# EAGLE design digital-psu (EAGLE 7.6.0)
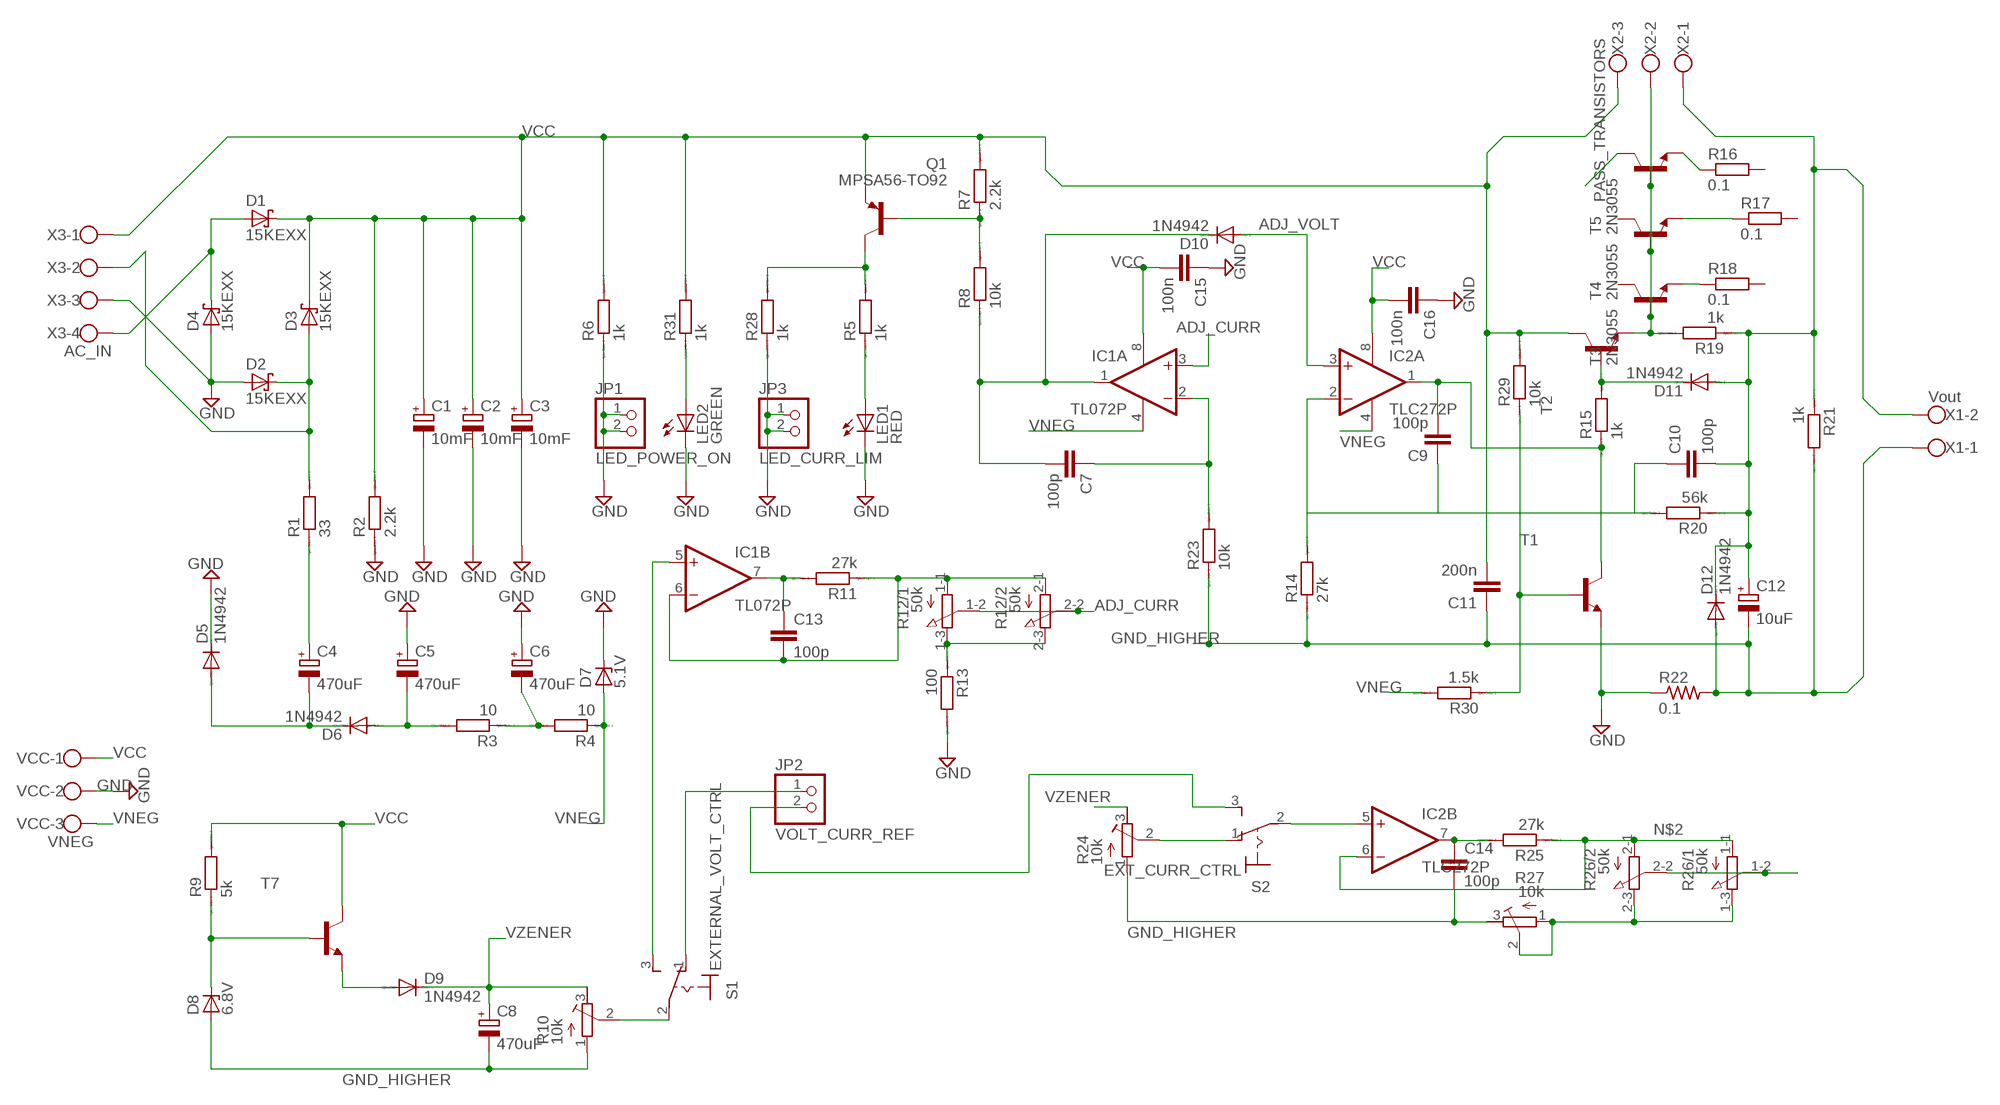
[diagram p0: schematic, sheet 1]

## Parts
C1  10mF  CPOL-EUE10-22.5  [EB22,5D]
C2  10mF  CPOL-EUE10-22.5  [EB22,5D]
C3  10mF  CPOL-EUE10-22.5  [EB22,5D]
C4  470uF  CPOL-EUE5-10.5  [E5-10,5]
C5  470uF  CPOL-EUE5-10.5  [E5-10,5]
C6  470uF  CPOL-EUE5-10.5  [E5-10,5]
C7  100p  C-EUC0805  [C0805]
C8  470uF  CPOL-EUE5-10.5  [E5-10,5]
C9  100p  C-EUC0805  [C0805]
C10  100p  C-EUC0805  [C0805]
C11  200n  C-EUC0805  [C0805]
C12  10uF  CPOL-EUE5-10.5  [E5-10,5]
C13  100p  C-EUC0805  [C0805]
C14  100p  C-EUC0805  [C0805]
C15  100n  C-EUC0805  [C0805]
C16  100n  C-EUC0805  [C0805]
D1  15KEXX  [CB429-17]
D2  15KEXX  [CB429-17]
D3  15KEXX  [CB429-17]
D4  15KEXX  [CB429-17]
D5  1N4942  [DO41-10]
D6  1N4942  [DO41-10]
D7  5.1V  ZENER-DIODEC1702-15  [C1702-15]
D8  6.8V  ZENER-DIODEC1702-15  [C1702-15]
D9  1N4942  [DO41-10]
D10  1N4942  [DO41-10]
D11  1N4942  [DO41-10]
D12  1N4942  [DO41-10]
IC1  TL072P  [DIL08]
IC2  TLC272P  [DIL08]
JP1  LED_POWER_ON  PINHD-1X2  [1X02]
JP2  VOLT_CURR_REF  PINHD-1X2  [1X02]
JP3  LED_CURR_LIM  PINHD-1X2  [1X02]
LED1  RED  LED5MM  [LED5MM]
LED2  GREEN  LED5MM  [LED5MM]
Q1  MPSA56-TO92  [TO92-CBE]
R1  33  R  [R0805]
R2  2.2k  R  [R0805]
R3  10  R  [R0805]
R4  10  R  [R0805]
R5  1k  R  [R0805]
R6  1k  R  [R0805]
R7  2.2k  R  [R0805]
R8  10k  R  [R0805]
R9  5k  R  [R0805]
R10  10k  R-TRIMM64W  [RTRIM64W]
R11  27k  R  [R0805]
R12  50k  3RP/1610G  [3RP/1610G]
R13  100  R  [R0805]
R14  27k  R  [R0805]
R15  1k  R  [R0805]
R16  0.1  R-EU_VTA55  [VTA55]
R17  0.1  R-EU_VTA55  [VTA55]
R18  0.1  R-EU_VTA55  [VTA55]
R19  1k  R  [R0805]
R20  56k  R  [R0805]
R21  1k  R  [R0805]
R22  0.1  R-US_VTA52  [VTA52]
R23  10k  R  [R0805]
R24  10k  R-TRIMM64W  [RTRIM64W]
R25  27k  R  [R0805]
R26  50k  3RP/1610G  [3RP/1610G]
R27  10k  R-TRIMM64W  [RTRIM64W]
R28  1k  R  [R0805]
R29  10k  R  [R0805]
R30  1.5k  R  [R0805]
R31  1k  R  [R0805]
S1  EXTERNAL_VOLT_CTRL  320-916  [320-916]
S2  EXT_CURR_CTRL  320-916  [320-916]
T1  -NPN-TO92-EBC  [TO92-EBC]
T2  -NPN-TO92-EBC  [TO92-EBC]
T3  2N3055  -NPN-TO3/  [TO3]
T4  2N3055  -NPN-TO3/  [TO3]
T5  2N3055  -NPN-TO3/  [TO3]
T7  -NPN-TO92-EBC  [TO92-EBC]
VCC  VNEG  W237-103  [W237-103]
X1  Vout  W237-113  [W237-113]
X2  PASS_TRANSISTORS  W237-103  [W237-103]
X3  AC_IN  W237-4  [W237-4]

## Nets
ADJ_CURR: IC1.3(A:+IN) R12.1-2(/1:S) R12.2-2(/2:S)
ADJ_VOLT: D10.A IC2.3(A:+IN) R26.1-2(/1:S) R26.2-2(/2:S)
GND: C1.- C2.- C3.- C5.+ C6.+ C15.1 C16.1 D2.A D4.A D5.C D7.C JP1.1 JP1.2 JP3.1 JP3.2 LED1.K(C) LED2.K(C) R2.1 R6.1 R13.2 R22.1 R28.1 T1.E VCC.2 X3.3
GND_HIGHER: C8.- C11.1 C12.- C14.2 D8.A D12.A R10.1(A) R14.1 R21.2 R22.2 R23.1 R24.1(A) R27.3(E) X1.1
N$1: D2.C D3.A R1.2 X3.2
N$2: IC2.6(B:-IN) R25.1 R26.1-1(/1:A) R26.2-1(/2:A)
N$3: D1.A D4.C X3.4
N$4: R10.2(S) S1.2(P)
N$6: C4.- D5.A D6.C
N$7: C5.- D6.A R3.2
N$8: C6.- R3.1 R4.2
N$9: T5.C
N$10: LED2.A R31.1
N$11: Q1.C R5.2 R28.2
N$12: LED1.A R5.1
N$14: Q1.B R7.1 R8.2
N$15: C7.2 D10.C IC1.1(A:OUT) R8.1
N$16: D8.C R9.1 T7.B
N$17: R29.1 R30.1 T1.B
N$18: C7.1 IC1.2(A:-IN) R23.2
N$19: D9.A T7.E
N$20: C13.2 IC1.6(B:-IN) R11.1 R12.1-1(/1:A) R12.2-1(/2:A)
N$22: JP2.2 S2.3(S)
N$23: C13.1 IC1.7(B:OUT) R11.2
N$24: R18.1 T3.E
N$25: R17.1 T4.E
N$26: R16.1 T5.E
N$27: R19.2 T2.E T3.B T4.B T5.B X2.2
N$28: D11.C R15.2 T2.B
N$29: R24.2(S) S2.1(O)
N$30: C14.1 IC2.7(B:OUT) R25.2
N$31: C9.2 IC2.1(A:OUT) R15.1 T1.C
N$32: R12.1-3(/1:E) R12.2-3(/2:E) R13.1
N$34: IC2.5(B:+IN) S2.2(P)
N$35: C4.+ R1.1
N$36: R26.1-3(/1:E) R26.2-3(/2:E) R27.1(A) R27.2(S)
N$38: C9.1 C10.1 IC2.2(A:-IN) R14.2 R20.2
N$41: C10.2 C12.+ D11.A D12.C R19.1 R20.1 R21.1 X1.2 X2.1
N$43: JP2.1 S1.1(O)
N$44: IC1.5(B:+IN) S1.3(S)
VCC: C1.+ C2.+ C3.+ C11.2 C15.2 C16.2 D1.C D3.C IC1.8(P:V+) IC2.8(P:V+) Q1.E R2.2 R6.2 R7.2 R9.2 R29.2 R31.2 T2.C T7.C VCC.1 X2.3 X3.1
VNEG: D7.A IC1.4(P:V-) IC2.4(P:V-) R4.1 R30.2 VCC.3
VZENER: C8.+ D9.C R10.3(E) R24.3(E)
Unconnected: R16.2 R17.2 R18.2 T3.C T4.C

## Library data of the parts
C1-C6 C8 C12 = resistor:CPOL-EU: POLARIZED CAPACITOR, European symbol
C7 C9-C11 C13-C16 = rcl:C-EU: CAPACITOR, European symbol
D1-D4 = diode:15KEXX: DIODE
D5 D6 D9-D12 = diode:1N4942: DIODE 1.0 A, 200 V, 150 ns
D7 D8 = diode:ZENER-DIODE: Z-Diode
IC1 = linear:TL072: OP AMP
IC2 = linear:TLC272: OP AMP
JP1-JP3 = pinhead:PINHD-1X2: PIN HEADER
LED1 LED2 = led:LED: LED OSRAM: - CHIPLED LG R971, LG N971, LY N971, LG Q971, LY Q971, LO R971, LY R971 LH N974, LH R974 LS Q976, LO Q976, LY Q976 LO Q996 - Hyper CHIPLED LW Q18S LB Q993, LB Q99A, LB R99A - SideLED LS A670, LO A670, LY A670, LG A670, LP A670 LB A673, LV A673, LT A673, LW A673 LH A674 LY A675 LS A676, LA A676, LO A676, LY A676, LW A676 LS A679, LY A679, LG A679 - Hyper Micro SIDELED® LS Y876, LA Y876, LO Y876, LY Y876 LT Y87S - SmartLED LW L88C, LW L88S LB L89C, LB L89S, LG L890 LS L89K, LO L89K, LY L89K LS L896, LA L896, LO L896, LY L896 - TOPLED LS T670, LO T670, LY T670, LG T670, LP T670 LSG T670, LSP T670, LSY T670, LOP T670, LYG T670 LG T671, LOG T671, LSG T671 LB T673, LV T673, LT T673, LW T673 LH T674 LS T676, LA T676, LO T676, LY T676, LB T676, LH T676, LSB T676, LW T676 LB T67C, LV T67C, LT T67C, LS T67K, LO T67K, LY T67K, LW E67C LS E67B, LA E67B, LO E67B, LY E67B, LB E67C, LV E67C, LT E67C LW T67C LS T679, LY T679, LG T679 LS T770, LO T770, LY T770, LG T770, LP T770 LB T773, LV T773, LT T773, LW T773 LH T774 LS E675, LA E675, LY E675, LS T675 LS T776, LA T776, LO T776, LY T776, LB T776 LHGB T686 LT T68C, LB T68C - Hyper Mini TOPLED® LB M676 - Mini TOPLED Santana® LG M470 LS M47K, LO M47K, LY M47K Source: http://www.osram.convergy.de LUXEON: - LUMILED® LXK2-PW12-R00, LXK2-PW12-S00, LXK2-PW14-U00, LXK2-PW14-V00 LXK2-PM12-R00, LXK2-PM12-S00, LXK2-PM14-U00 LXK2-PE12-Q00, LXK2-PE12-R00, LXK2-PE12-S00, LXK2-PE14-T00, LXK2-PE14-U00 LXK2-PB12-K00, LXK2-PB12-L00, LXK2-PB12-M00, LXK2-PB14-N00, LXK2-PB14-P00, LXK2-PB14-Q00 LXK2-PR12-L00, LXK2-PR12-M00, LXK2-PR14-Q00, LXK2-PR14-R00 LXK2-PD12-Q00, LXK2-PD12-R00, LXK2-PD12-S00 LXK2-PH12-R00, LXK2-PH12-S00 LXK2-PL12-P00, LXK2-PL12-Q00, LXK2-PL12-R00 Source: www.luxeon.com KINGBRIGHT: KA-3528ASYC Source: www.kingbright.com
Q1 = transistor-pnp:*-?: PNP Transistor
R1-R9 R11 R13-R15 R19-R21 R23 R25 R28-R31 = eagle-ltspice:R: RESISTOR, European symbol; SPICEMODEL: NONE; SPICEPREFIX: R
R10 R24 R27 = rcl:R-TRIMM: Trimm resistor
R12 R26 = pot:3RP/1610G: 16mm Potentiometer two level Source: http://www.alphapotentiometers.net/html/16mm_pot_2.html
R16-R18 = rcl:R-EU_: RESISTOR, European symbol
R22 = rcl:R-US_: RESISTOR, American symbol
S1 S2 = switch:320-916: TOGGLE SWITCH distributor RS Components
T1-T5 T7 = transistor:*-NPN-: NPN Transistror BF959 corrected 2008.03.06
VCC X2 = con-wago-500:W237-103: WAGO SCREW CLAMP; MPN: 237-103; OC_FARNELL: unknown; OC_NEWARK: 18M7116
X1 = con-wago-500:W237-113: WAGO SCREW CLAMP; OC_FARNELL: unknown; OC_NEWARK: unknown
X3 = con-wago-500:W237-4: WAGO SCREW CLAMP; OC_FARNELL: unknown; OC_NEWARK: unknown

## Board
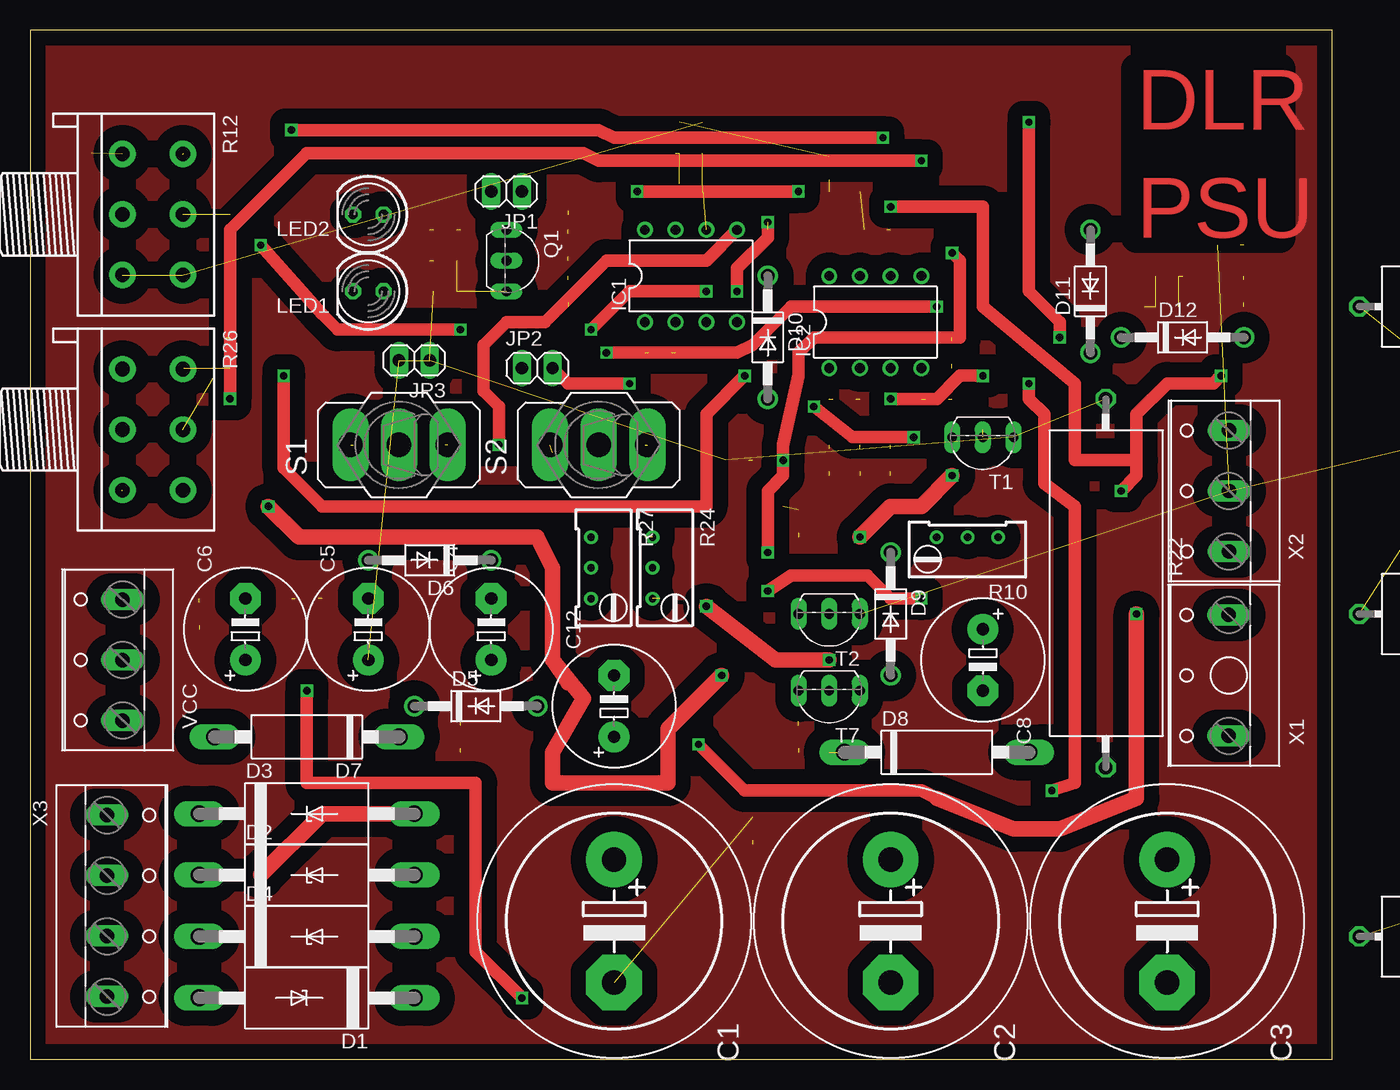
[diagram p1: board, top side]
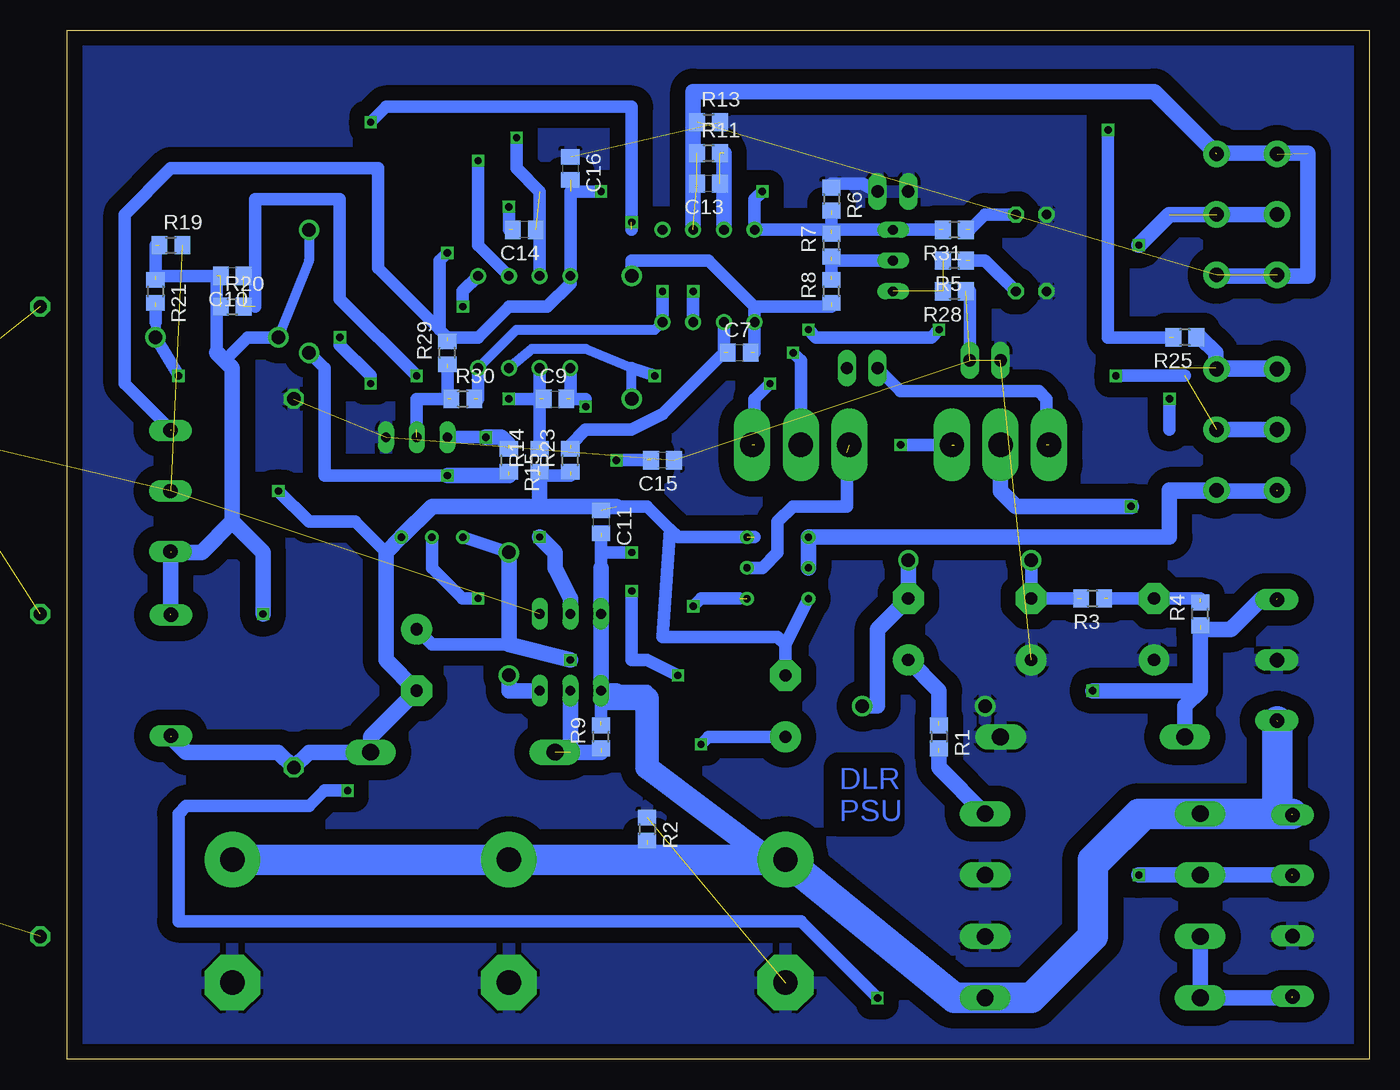
[diagram p2: board, bottom side, seen from below]

Size 107.62 x 85.08 mm. Coordinates in mm from the lower left corner, seen from the top.
Outline: 0,0 107.62,0 107.62,85.08 0,85.08 0,0
Copper layers (1*16): Top 0.035mm / dielectric 1.5mm / Bottom 0.035mm
Design rules "default": minimum track width 10mil, minimum drill 24mil, track to track 8mil, track to pad 8mil, pad to pad 8mil, via to via 8mil, smd to smd 8mil, copper to edge 40mil, drill to drill 8mil, minimum pad ring 10mil, minimum via ring 8mil, stop-mask expansion 4mil, vias tented up to drill 0mil, thermal gap 10mil

### Footprints (pad centres in the part's own frame; a part is rotated, then mirrored left to right if it is on the bottom)
EB22,5D = drill 2.007 pad 4.597: + -5.08,0 | drill 2.007 pad 4.597 octagon: - 5.08,0
E5-10,5 = drill 1.016 pad 2.54: + -2.54,0 | drill 1.016 pad 2.54 octagon: - 2.54,0
C0805 = smd 1.3 x 1.5: 1 -0.95,0; 2 0.95,0
CB429-17 = drill 1.397 long: A 8.89,0; C -8.89,0
DO41-10 = drill 1.118: A 5.08,0; C -5.08,0
C1702-15 = drill 1.397 long: A 7.62,0; C -7.62,0
DIL08 = drill 0.813 pad 1.27: 1 -3.81,-3.81; 2 -1.27,-3.81; 3 1.27,-3.81; 4 3.81,-3.81; 5 3.81,3.81; 6 1.27,3.81; 7 -1.27,3.81; 8 -3.81,3.81
1X02 = drill 1.016 long: 1 -1.27,0; 2 1.27,0
LED5MM = drill 0.813 octagon: A -1.27,0; K 1.27,0
TO92-CBE = drill 0.813 long: B 0,0; C 2.54,0; E -2.54,0
R0805 = smd 1.3 x 1.5: 1 -0.95,0; 2 0.95,0
RTRIM64W = drill 0.61: 1 1.27,-2.54; 2 1.27,0; 3 1.27,2.54
3RP/1610G = drill 1.2 pad 2.184: 1-1 -5,0; 1-2 0,0; 1-3 5,0; 2-1 -5,5; 2-2 0,5; 2-3 5,5
VTA55 = drill 1.1 octagon: 1 -8.255,0; 2 8.255,0
VTA52 = drill 1.1 octagon: 1 -15.24,0; 2 15.24,0
320-916 = drill 2.007 long: 1 0,4.013; 2 0,0; 3 0,-4.013
TO92-EBC = drill 0.813 long: B 0,-1.27; C 2.54,-1.27; E -2.54,-1.27
TO3 = drill 1.194 pad 3.15 long: B -1.778,5.461; E -1.778,-5.461 | drill 4.115 pad 6.477: C 15.113,0; C/ -15.113,0
W237-103 = drill 1.194 long: 1 -5,-1.29; 2 0,-1.29; 3 5,-1.29
W237-113 = drill 1.194 long: 1 -5,-1.27; 2 5,-1.27
W237-4 = drill 1.194 long: 1 -7.5,-1.27; 2 -2.5,-1.27; 3 2.5,-1.27; 4 7.5,-1.27

### Placement (x,y rotation side)
C1  48.26,11.43 270 top
C2  71.12,11.43 270 top
C3  93.98,11.43 270 top
C4  38.1,35.56 90 top
C5  27.94,35.56 90 top
C6  17.78,35.56 90 top
C7  52.07,58.42 0 bottom
C8  78.74,33.02 270 top
C9  67.31,54.61 0 bottom
C10  93.98,64.77 180 bottom
C11  63.5,44.45 270 bottom
C12  48.26,29.21 90 top
C13  54.61,72.39 180 bottom
C14  69.85,68.58 180 bottom
C15  58.42,49.53 180 bottom
C16  66.04,73.66 270 bottom
D1  22.86,5.08 180 top
D2  22.86,15.24 0 top
D3  22.86,20.32 0 top
D4  22.86,10.16 0 top
D5  36.83,29.21 0 top
D6  33.02,41.27 180 top
D7  22.86,26.67 180 top
D8  74.93,25.4 0 top
D9  71.12,36.83 270 top
D10  60.96,59.69 270 top
D11  87.63,63.5 90 top
D12  95.25,59.69 0 top
IC1  54.61,64.77 0 top
IC2  69.85,60.96 0 top
JP1  39.37,71.76 180 top
JP2  41.91,57.15 0 top
JP3  31.75,57.78 180 top
LED1  27.94,63.5 180 top
LED2  27.94,69.85 180 top
Q1  39.37,66.04 270 top
R1  35.56,26.67 270 bottom
R2  59.69,19.05 270 bottom
R3  22.86,38.1 180 bottom
R4  13.97,36.83 90 bottom
R5  34.29,66.04 180 bottom
R6  44.45,71.12 270 bottom
R7  44.45,67.31 90 bottom
R8  44.45,63.5 90 bottom
R9  63.5,26.67 90 bottom
R10  77.47,41.91 90 top
R11  54.61,74.93 0 bottom
R12  7.62,69.85 270 top
R13  54.61,77.47 0 bottom
R14  68.58,49.53 90 bottom
R15  71.12,49.53 270 bottom
R16  118.11,10.16 0 top
R17  118.11,36.83 0 top
R18  118.11,62.23 0 top
R19  99.06,67.31 0 bottom
R20  93.98,62.23 0 bottom
R21  100.33,63.5 270 bottom
R22  88.9,39.37 270 top
R23  66.04,49.53 90 bottom
R24  52.7,40.64 180 top
R25  15.24,59.69 180 bottom
R26  7.62,52.07 270 top
R27  47.62,40.64 180 top
R28  34.29,63.5 180 bottom
R29  76.2,58.42 90 bottom
R30  74.93,54.61 0 bottom
R31  34.29,68.58 180 bottom
S1  30.48,50.8 90 top
S2  46.99,50.8 90 top
T1  78.74,50.16 180 top
T2  66.04,35.56 180 top
T3  134.62,49.53 0 top  (outside the outline)
T4  133.35,76.2 0 top  (outside the outline)
T5  134.62,22.86 0 top  (outside the outline)
T7  66.04,29.21 180 top
VCC  6.35,33.02 90 top
X1  97.79,31.75 90 top
X2  97.79,46.99 90 top
X3  7.62,12.7 270 top

### Tracks (layer width: path | path; a pad name or v marks a point on that pad's centre or on a via)
ADJ_CURR  (via drill 0.6)  (1 unrouted)
  Top 1.016: v55.88,63.5 49.53,63.5 v46.35,60.32 | v35.56,60.32 25.4,60.32 24.13,61.59 v19.05,67.31
  Bottom 1.016: IC1.3 v55.88,63.5 | v46.35,60.32 45.72,59.69 36.2,59.69 v35.56,60.32
  Bottom 1.27: R12.1-2 16.51,69.85 v19.05,67.31
ADJ_VOLT  (via drill 0.6)  (1 unrouted)
  Top 1.016: v59.05,56.52 55.88,53.34 55.88,45.72 24.13,45.72 20.95,48.89 v20.95,56.52
  Bottom 0.813: D10.A 60.96,57.15 64.77,58.74 69.22,58.74 IC2.3
  Bottom 1.016: 60.96,57.15 v59.05,56.52 | v20.95,56.52 15.24,56.52
  Bottom 1.27: R26.1-2 R26.2-2
GND  (8 unrouted)
  Bottom 1.016: JP1.1 41.91,72.39 44.45,72.39
  pour Bottom (isolate 1.27): -2.54,88.9 115.57,88.9 115.57,83.82 115.57,-5.08 -8.89,-5.08 -8.89,-2.54 -8.89,88.9
GND_HIGHER  (via drill 0.6)  (7 unrouted)
  Top 1.016: v90.17,46.99 91.44,48.26 91.44,49.53 | 91.44,49.53 91.44,53.34 93.98,55.88 97.79,55.88 v98.43,56.52 | 91.44,49.53 86.36,49.53 86.36,55.88 78.74,62.23 78.74,70.48 v71.12,70.48
  Bottom 0.813: 100.33,60.96 D12.A
  Bottom 1.016: 81.28,41.91 83.82,44.45 87.63,44.45 v90.17,46.99 | v98.43,56.52 D12.A | 100.33,60.96 100.33,62.23 | 66.04,48.26 68.58,48.26 | 71.12,68.58 v71.12,70.48 | R27.3 48.26,34.29 | 48.26,34.29 C12.- | 50.8,43.18 57.15,43.18 57.78,43.81 | 57.78,43.81 59.69,45.72 62.23,45.72 | 48.26,34.29 48.89,34.92 58.42,34.92 57.78,43.81
  Bottom 1.27: 99.06,26.67 97.79,25.4 90.17,25.4 R22.2 87.63,25.4 D8.A 82.55,26.67 C8.- 81.28,33.02 81.28,41.91 R10.1 77.47,45.72 68.58,45.72 | 68.58,48.26 68.58,45.72 | 62.23,45.72 68.58,45.72
N$1  (via drill 0.6)  (2 unrouted)
  Top 1.27: v19.05,15.24 24.13,20.32 D3.A
  Bottom 1.27: 6.35,15.24 D2.C v19.05,15.24 | D3.A 35.56,24.13 35.56,25.4
N$2  (via drill 0.6)  (1 unrouted)
  Top 1.016: v73.66,74.3 46.99,74.3 45.72,74.93 22.86,74.93 16.51,68.58 v16.51,54.61
  Bottom 1.016: 16.51,52.07 v16.51,54.61 | IC2.6 73.66,67.31 v73.66,74.3
  Bottom 1.27: R26.1-1 R26.2-1 12.7,57.07 12.7,57.15 12.7,58.42 13.97,59.69 R25.1
N$3  (1 unrouted)
  Bottom 1.27: 6.35,5.08 D1.A D4.C
N$4  (via drill 0.6)
  Top 1.016: v73.66,38.1 71.12,38.1 69.22,40.01 62.87,40.01 v60.96,38.73
  Top 1.27: v19.68,45.72 22.22,43.18 41.91,43.18 43.18,40.64 43.18,33.02 | 43.18,33.02 44.45,31.11 | 43.18,33.02 45.72,29.84 43.18,25.4 43.18,22.86 52.7,22.86 52.7,27.3 v57.15,31.75
  Bottom 1.016: R10.2 77.47,40.64 74.93,38.1 v73.66,38.1 | v60.96,38.73 60.96,33.02 59.69,33.02 v57.15,31.75
  Bottom 1.27: S1.2 30.48,46.99 29.21,45.72 v19.68,45.72
N$5
  Bottom 1.27: 7.62,57.15 12.7,57.15 12.7,58.42 13.97,59.69
N$6
  Bottom 1.27: D5.A 40.64,29.21 40.64,35.56 C4.- D6.C
N$7  (1 unrouted)
  Bottom 1.016: D6.A C5.- 24.13,38.1
N$8  (2 unrouted)
  Bottom 1.016: 21.59,38.1 C6.- 13.97,38.1
N$10  (1 unrouted)
  Bottom 1.016: 33.02,68.58 31.75,69.85 LED2.A
N$11  (2 unrouted)
N$12  (1 unrouted)
  Bottom 1.016: LED1.A 31.75,66.04 33.02,66.04
N$13
  pour Top (isolate 1.27): 0,85.09 0,0 107.95,0 107.95,85.09
N$14  (2 unrouted)
  Bottom 1.016: Q1.B 44.45,66.04 44.45,64.77
N$15  (2 unrouted)
  Bottom 1.016: 50.8,58.42 IC1.1 50.8,62.23 | 50.8,62.23 54.61,66.04 60.96,66.04 D10.C | 50.8,62.23 44.45,62.23
N$16  (2 unrouted)
  Bottom 1.27: 63.5,25.4 66.04,25.4 T7.B
N$17  (3 unrouted)
  Bottom 1.016: 76.2,57.15 76.2,54.61 78.74,54.61 78.74,52.07
N$18  (2 unrouted)
  Bottom 1.016: 66.04,50.8 64.77,52.07 60.96,52.07 58.42,53.34 53.34,58.42 IC1.2
N$19
  Bottom 1.27: T7.E 71.12,30.48 D9.A
N$20  (4 unrouted)
  Bottom 1.27: IC1.6 55.88,80.01 17.78,80.01 12.7,74.93 5.08,74.93 5.08,64.77 12.7,64.77
N$21
  Bottom 1.016: 33.02,63.5 33.02,57.15
N$22  (via drill 0.6)  (1 unrouted)
  Top 1.016: v49.53,55.88 44.45,55.88 JP2.2
  Bottom 1.016: 50.8,50.8 50.8,54.61 v49.53,55.88
N$23  (2 unrouted)
  Bottom 1.27: IC1.7 53.34,74.93
N$24  (1 unrouted)
N$25  (1 unrouted)
N$26  (1 unrouted)
N$27  (5 unrouted)
N$28  (via drill 0.6)  (1 unrouted)
  Top 1.27: v68.58,43.18 71.12,45.72 73.66,45.72 v76.2,48.26
  Bottom 1.016: v76.2,48.26 86.36,48.26 86.36,57.15 D11.C
  Bottom 1.27: T2.B 66.04,38.1 67.31,40.64 67.31,41.91 v68.58,43.18 | v76.2,48.26 71.12,48.26
N$29  (1 unrouted)
  Bottom 1.016: R24.2 50.16,40.64 48.89,41.91 48.89,44.45 47.62,45.72 43.18,45.72 43.18,50.16
N$30  (via drill 0.6)  (2 unrouted)
  Top 1.016: v70.48,76.2 48.26,76.2 46.99,76.84 v21.59,76.84
  Bottom 1.016: IC2.7 68.58,71.76 70.48,73.66 v70.48,76.2 | v21.59,76.84 21.59,59.69 16.51,59.69
N$31  (via drill 0.6)  (2 unrouted)
  Top 1.016: v64.77,53.98 67.95,51.44 v73.03,51.44
  Bottom 1.016: IC2.1 66.04,54.61 64.77,54.61 v64.77,53.98 | v73.03,51.44 T1.C
  Bottom 1.27: 71.12,50.8 71.76,51.44 v73.03,51.44
N$32  (2 unrouted)
N$34  (via drill 0.6)
  Top 1.016: v74.93,62.23 62.87,62.23 59.69,59.05 58.42,58.42 v47.62,58.42
  Bottom 1.016: IC2.5 74.93,63.5 v74.93,62.23 | S2.2 46.99,57.78 v47.62,58.42
N$35  (1 unrouted)
  Bottom 1.27: 35.56,27.94 35.56,30.48 C4.+
N$36  (1 unrouted)
  Bottom 1.27: 16.51,46.99 16.51,43.18 R27.1 R27.2 | 7.62,46.99 16.51,46.99 | 15.24,46.99 12.62,46.99 R26.2-3 16.51,47.07 16.51,46.99
N$38  (via drill 0.6)  (4 unrouted)
  Top 1.016: v71.12,54.61 74.93,54.61 76.84,56.52 v78.74,56.52
  Bottom 1.016: IC2.2 68.58,54.61 | 68.58,54.61 68.58,50.8 | 68.58,54.61 v71.12,54.61 | v78.74,56.52 85.09,62.87 85.09,71.12 92.08,71.12 92.08,62.23
N$41  (via drill 0.6)  (6 unrouted)
  Top 1.016: v55.24,26.04 59.05,22.22 73.66,22.22 74.93,21.59
  Top 1.27: v91.44,36.83 91.44,21.59 85.09,19.05 81.28,19.05 74.93,21.59
  Bottom 0.813: D11.A 87.63,66.04 D12.C
  Bottom 1.016: 95.25,58.42 95.25,64.77 100.33,64.77 100.33,67.31 | D12.C 92.71,59.69 94.62,57.78 | C12.+ 54.61,26.67 v55.24,26.04
  Bottom 1.27: 95.25,58.42 94.62,57.78 93.98,57.15 93.98,44.45 | 93.98,44.45 96.52,41.91 99.06,41.91 99.06,36.83 | v91.44,36.83 91.44,41.91 93.98,44.45
N$43  (1 unrouted)
  Bottom 1.016: 26.67,50.8 26.67,54.61 27.3,55.24 38.73,55.24 JP2.1
N$44  (via drill 0.6)  (1 unrouted)
  Top 1.016: v38.73,50.8 38.73,53.98 37.46,55.24 37.46,59.05 39.37,60.96 42.55,60.96 47.62,66.04 55.88,66.04 IC1.5
  Bottom 1.016: 34.29,50.8 v38.73,50.8
VCC  (via drill 0.6)  (12 unrouted)
  Top 1.016: v60.96,41.91 60.96,46.99 62.23,48.26 v62.23,49.53 62.23,50.8 63.5,56.52 63.5,58.42 64.77,59.69 76.84,59.69 76.84,66.04 v76.2,66.68 | v50.16,71.76 v63.5,71.76
  Bottom 1.016: 59.69,16.51 59.69,17.78 | 99.06,52.07 102.87,55.88 102.87,69.85 99.06,73.66 81.92,73.66 81.92,65.41 76.84,60.32 | 76.84,60.32 76.2,59.69 73.66,59.69 71.12,62.23 67.95,62.23 66.04,64.14 IC2.8 66.04,71.76 v63.5,71.76 | 63.5,43.18 63.5,41.91 | 63.5,41.91 63.5,40.64 | 63.5,41.91 v60.96,41.91 | v62.23,49.53 59.69,49.53 | 44.45,68.58 Q1.E 35.56,68.58 | 44.45,68.58 IC1.8 | IC1.8 50.8,70.48 | IC1.8 50.8,71.12 v50.16,71.76 | 44.45,68.58 44.45,69.85 | v76.2,66.68 76.84,66.04 76.84,60.32 | 63.5,27.94 T7.C | 62.23,30.48 59.69,30.48 59.69,29.84 | 59.69,24.13 48.26,15.24
  Bottom 1.27: 7.62,20.32 D3.C 17.78,20.32 22.86,15.24 22.86,10.16 | 6.35,20.32 7.62,21.59 7.62,27.94 | 62.23,30.48 T7.C T2.C 63.5,40.64
  Bottom 1.93: 49.53,16.51 59.69,24.13 59.69,29.84 62.87,29.84
  Bottom 2.54: C3.+ C2.+ 59.69,16.51 49.53,16.51 C1.+ 34.29,5.08 D1.C 27.94,5.08 22.86,10.16 22.86,16.51 19.05,20.32 7.62,20.32 | 6.35,20.32 7.62,20.32 | 7.62,20.32 7.62,27.94
VNEG  (via drill 0.6)  (4 unrouted)
  Top 1.016: v58.42,63.5 58.42,65.41 60.96,67.95 v60.96,69.22 | v85.09,59.69 85.09,60.96 82.55,63.5 v82.55,77.47 | v82.55,55.88 82.55,54.61 83.82,53.34 83.82,47.62 86.36,45.72 86.36,22.86 v84.46,22.22 | v40.64,5.08 36.83,8.89 36.83,22.86 22.86,22.86 v22.86,30.48
  Bottom 0.813: IC2.4 70.48,60.32 59.05,60.32 IC1.4
  Bottom 1.016: IC1.4 v58.42,63.5 | IC2.4 73.66,54.61 | 60.96,68.58 60.96,78.74 81.28,78.74 v82.55,77.47 | v85.09,59.69 85.09,59.05 82.55,56.52 v82.55,55.88 | v84.46,22.22 86.36,22.22 87.63,20.95 97.79,20.95 98.43,20.32 98.43,11.43 46.99,11.43 v40.64,5.08
  Bottom 1.27: D7.A 15.24,29.21 13.97,30.48 | 13.97,30.48 13.97,35.56 11.43,35.56 8.89,38.1 7.62,38.1 | 13.97,30.48 v22.86,30.48
VZENER  (via drill 0.6)  (1 unrouted)
  Top 1.27: 62.23,33.02 v66.04,33.02 61.59,33.02 v55.88,37.46
  Bottom 1.016: R10.3 D9.C | 71.12,34.29 77.47,34.29 C8.+ | 52.07,38.1 55.24,38.1 v55.88,37.46
  Bottom 1.27: v66.04,33.02 71.12,34.29 D9.C

### Text on the board
Top: DLR / PSU
Bottom: DLR / PSU